# Altium schematic sheet Basic-Logic-Gates-Sheet.SchDoc
size A; SheetNumber: 1; SheetTotal: 1
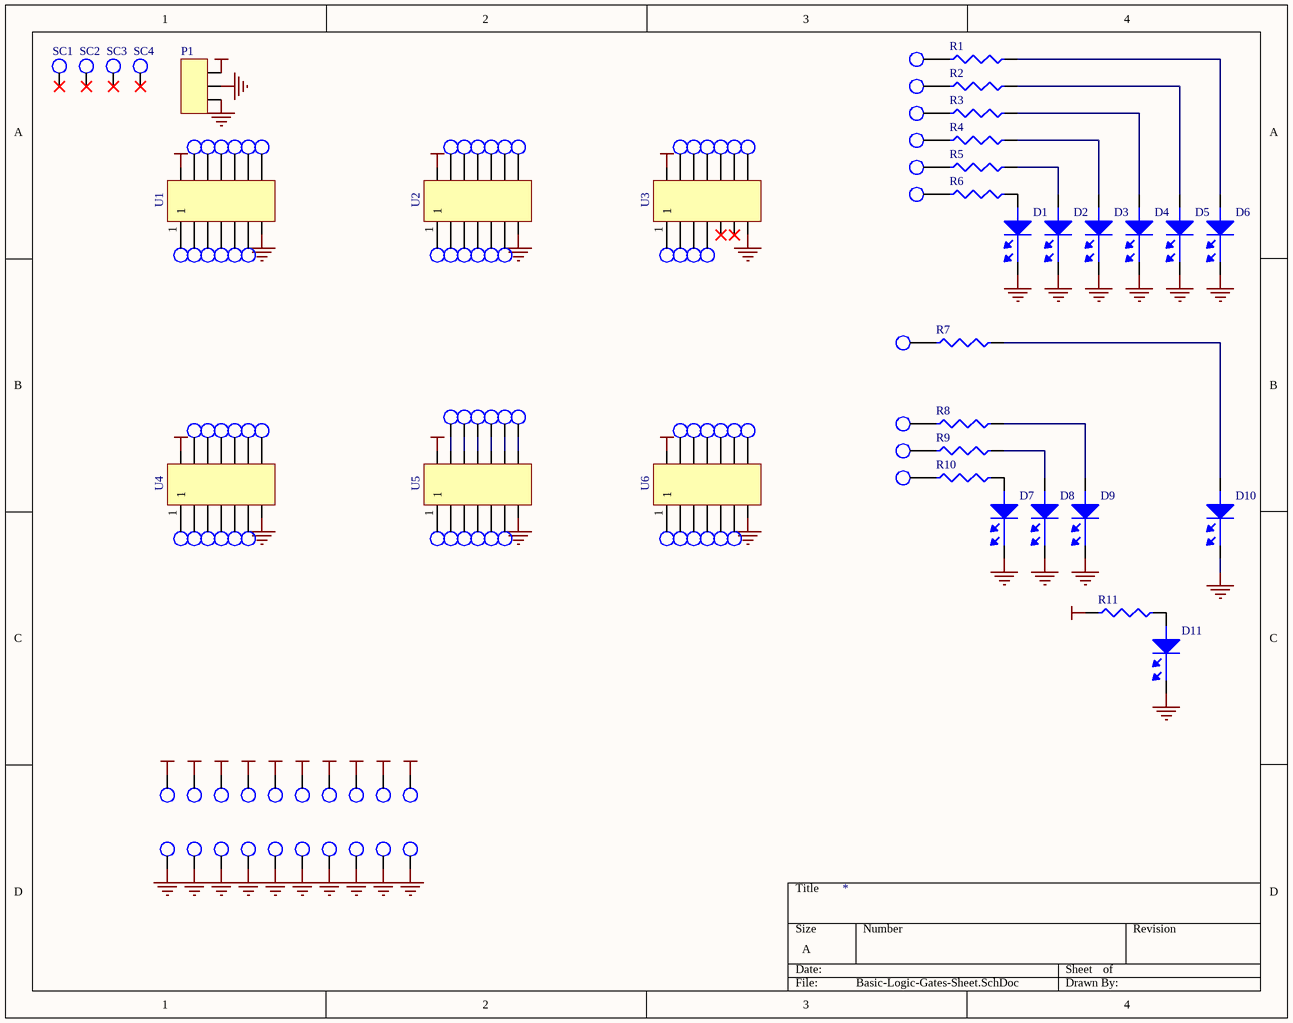
[diagram p0: Basic-Logic-Gates-Sheet.SchDoc]

## Parts
D1  5mm LED  [LED]  (value not drawn)
D2  5mm LED  [LED]  (value not drawn)
D3  5mm LED  [LED]  (value not drawn)
D4  5mm LED  [LED]  (value not drawn)
D5  5mm LED  [LED]  (value not drawn)
D6  5mm LED  [LED]  (value not drawn)
D7  5mm LED  [LED]  (value not drawn)
D8  5mm LED  [LED]  (value not drawn)
D9  5mm LED  [LED]  (value not drawn)
D10  5mm LED  [LED]  (value not drawn)
D11  5mm LED  [LED]  (value not drawn)
J1  Jack  [Connector]  (value not drawn)
J2  Jack  [Connector]  (value not drawn)
J3  Jack  [Connector]  (value not drawn)
J4  Jack  [Connector]  (value not drawn)
J5  Jack  [Connector]  (value not drawn)
J6  Jack  [Connector]  (value not drawn)
J7  Jack  [Connector]  (value not drawn)
J8  Jack  [Connector]  (value not drawn)
J9  Jack  [Connector]  (value not drawn)
J10  Jack  [Connector]  (value not drawn)
J11  Jack  [Connector]  (value not drawn)
J12  Jack  [Connector]  (value not drawn)
J13  Jack  [Connector]  (value not drawn)
J14  Jack  [Connector]  (value not drawn)
J15  Jack  [Connector]  (value not drawn)
J16  Jack  [Connector]  (value not drawn)
J17  Jack  [Connector]  (value not drawn)
J18  Jack  [Connector]  (value not drawn)
J19  Jack  [Connector]  (value not drawn)
J20  Jack  [Connector]  (value not drawn)
J21  Jack  [Connector]  (value not drawn)
J22  Jack  [Connector]  (value not drawn)
J23  Jack  [Connector]  (value not drawn)
J24  Jack  [Connector]  (value not drawn)
J25  Jack  [Connector]  (value not drawn)
J26  Jack  [Connector]  (value not drawn)
J27  Jack  [Connector]  (value not drawn)
J28  Jack  [Connector]  (value not drawn)
J29  Jack  [Connector]  (value not drawn)
J30  Jack  [Connector]  (value not drawn)
J31  Jack  [Connector]  (value not drawn)
J32  Jack  [Connector]  (value not drawn)
J33  Jack  [Connector]  (value not drawn)
J34  Jack  [Connector]  (value not drawn)
J35  Jack  [Connector]  (value not drawn)
J36  Jack  [Connector]  (value not drawn)
J37  Jack  [Connector]  (value not drawn)
J38  Jack  [Connector]  (value not drawn)
J39  Jack  [Connector]  (value not drawn)
J40  Jack  [Connector]  (value not drawn)
J41  Jack  [Connector]  (value not drawn)
J42  Jack  [Connector]  (value not drawn)
J43  Jack  [Connector]  (value not drawn)
J44  Jack  [Connector]  (value not drawn)
J45  Jack  [Connector]  (value not drawn)
J46  Jack  [Connector]  (value not drawn)
J47  Jack  [Connector]  (value not drawn)
J48  Jack  [Connector]  (value not drawn)
J49  Jack  [Connector]  (value not drawn)
J50  Jack  [Connector]  (value not drawn)
J51  Jack  [Connector]  (value not drawn)
J52  Jack  [Connector]  (value not drawn)
J53  Jack  [Connector]  (value not drawn)
J54  Jack  [Connector]  (value not drawn)
J55  Jack  [Connector]  (value not drawn)
J56  Jack  [Connector]  (value not drawn)
J57  Jack  [Connector]  (value not drawn)
J58  Jack  [Connector]  (value not drawn)
J59  Jack  [Connector]  (value not drawn)
J60  Jack  [Connector]  (value not drawn)
J61  Jack  [Connector]  (value not drawn)
J62  Jack  [Connector]  (value not drawn)
J63  Jack  [Connector]  (value not drawn)
J64  Jack  [Connector]  (value not drawn)
J65  Jack  [Connector]  (value not drawn)
J66  Jack  [Connector]  (value not drawn)
J67  Jack  [Connector]  (value not drawn)
J68  Jack  [Connector]  (value not drawn)
J69  Jack  [Connector]  (value not drawn)
J70  Jack  [Connector]  (value not drawn)
J71  Jack  [Connector]  (value not drawn)
J72  Jack  [Connector]  (value not drawn)
J73  Jack  [Connector]  (value not drawn)
J74  Jack  [Connector]  (value not drawn)
J75  Jack  [Connector]  (value not drawn)
J76  Jack  [Connector]  (value not drawn)
J77  Jack  [Connector]  (value not drawn)
J78  Jack  [Connector]  (value not drawn)
J79  Jack  [Connector]  (value not drawn)
J80  Jack  [Connector]  (value not drawn)
J81  Jack  [Connector]  (value not drawn)
J82  Jack  [Connector]  (value not drawn)
J83  Jack  [Connector]  (value not drawn)
J84  Jack  [Connector]  (value not drawn)
J85  Jack  [Connector]  (value not drawn)
J86  Jack  [Connector]  (value not drawn)
J87  Jack  [Connector]  (value not drawn)
J88  Jack  [Connector]  (value not drawn)
J89  Jack  [Connector]  (value not drawn)
J90  Jack  [Connector]  (value not drawn)
J91  Jack  [Connector]  (value not drawn)
J92  Jack  [Connector]  (value not drawn)
J93  Jack  [Connector]  (value not drawn)
J94  Jack  [Connector]  (value not drawn)
J95  Jack  [Connector]  (value not drawn)
J96  Jack  [Connector]  (value not drawn)
J97  Jack  [Connector]  (value not drawn)
J98  Jack  [Connector]  (value not drawn)
J99  Jack  [Connector]  (value not drawn)
J100  Jack  [Connector]  (value not drawn)
P1  Power-Point  [Power-Point]  (value not drawn)
R1  Through Hole Resistor  [TH-Resistor]  (value not drawn)
R2  Through Hole Resistor  [TH-Resistor]  (value not drawn)
R3  Through Hole Resistor  [TH-Resistor]  (value not drawn)
R4  Through Hole Resistor  [TH-Resistor]  (value not drawn)
R5  Through Hole Resistor  [TH-Resistor]  (value not drawn)
R6  Through Hole Resistor  [TH-Resistor]  (value not drawn)
R7  Through Hole Resistor  [TH-Resistor]  (value not drawn)
R8  Through Hole Resistor  [TH-Resistor]  (value not drawn)
R9  Through Hole Resistor  [TH-Resistor]  (value not drawn)
R10  Through Hole Resistor  [TH-Resistor]  (value not drawn)
R11  Through Hole Resistor  [TH-Resistor]  (value not drawn)
SC1  Screw-Hole-Point  [Screw-Hole-Point]  (value not drawn)
SC2  Screw-Hole-Point  [Screw-Hole-Point]  (value not drawn)
SC3  Screw-Hole-Point  [Screw-Hole-Point]  (value not drawn)
SC4  Screw-Hole-Point  [Screw-Hole-Point]  (value not drawn)
U1  7400 series IC base  [DIP14]  (value not drawn)
U2  7400 series IC base  [DIP14]  (value not drawn)
U3  7400 series IC base  [DIP14]  (value not drawn)
U4  7400 series IC base  [DIP14]  (value not drawn)
U5  7400 series IC base  [DIP14]  (value not drawn)
U6  7400 series IC base  [DIP14]  (value not drawn)

## Nets
+5: J81.1 J82.1 J83.1 J84.1 J85.1 J86.1 J87.1 J88.1 J89.1 J90.1 P1.1(VCC) R11.1 U1.14 U2.14 U3.14 U4.14 U5.14 U6.14
GND: D1.1 D2.1 D3.1 D4.1 D5.1 D6.1 D7.1 D8.1 D9.1 D10.1 D11.1 J91.1 J92.1 J93.1 J94.1 J95.1 J96.1 J97.1 J98.1 J99.1 J100.1 P1.2(GND) P1.3(GND) U1.7 U2.7 U3.7 U4.7 U5.7 U6.7
NetD1_2: D1.2 R6.2
NetD2_2: D2.2 R5.2
NetD3_2: D3.2 R4.2
NetD4_2: D4.2 R3.2
NetD5_2: D5.2 R2.2
NetD6_2: D6.2 R1.2
NetD7_2: D7.2 R10.2
NetD8_2: D8.2 R9.2
NetD9_2: D9.2 R8.2
NetD10_2: D10.2 R7.2
NetD11_2: D11.2 R11.2
NetJ1_1: J1.1 R1.1
NetJ2_1: J2.1 R2.1
NetJ3_1: J3.1 R3.1
NetJ4_1: J4.1 R4.1
NetJ5_1: J5.1 U1.13
NetJ6_1: J6.1 U1.12
NetJ7_1: J7.1 U1.11
NetJ8_1: J8.1 U1.10
NetJ9_1: J9.1 U1.9
NetJ10_1: J10.1 U1.8
NetJ11_1: J11.1 U2.13
NetJ12_1: J12.1 U2.12
NetJ13_1: J13.1 U2.11
NetJ14_1: J14.1 U2.10
NetJ15_1: J15.1 U2.9
NetJ16_1: J16.1 U2.8
NetJ17_1: J17.1 U3.13
NetJ18_1: J18.1 U3.12
NetJ19_1: J19.1 U3.11
NetJ20_1: J20.1 U3.10
NetJ21_1: J21.1 U3.9
NetJ22_1: J22.1 U3.8
NetJ23_1: J23.1 R5.1
NetJ24_1: J24.1 R6.1
NetJ25_1: J25.1 U1.1
NetJ26_1: J26.1 U1.2
NetJ27_1: J27.1 U1.3
NetJ28_1: J28.1 U1.4
NetJ29_1: J29.1 U1.5
NetJ30_1: J30.1 U1.6
NetJ31_1: J31.1 U2.1
NetJ32_1: J32.1 U2.2
NetJ33_1: J33.1 U2.3
NetJ34_1: J34.1 U2.4
NetJ35_1: J35.1 U2.5
NetJ36_1: J36.1 U2.6
NetJ37_1: J37.1 U3.1
NetJ38_1: J38.1 U3.2
NetJ39_1: J39.1 U3.3
NetJ40_1: J40.1 U3.4
NetJ41_1: J41.1 R7.1
NetJ42_1: J42.1 R8.1
NetJ43_1: J43.1 U5.13
NetJ44_1: J44.1 U5.12
NetJ45_1: J45.1 U5.11
NetJ46_1: J46.1 U5.10
NetJ47_1: J47.1 U5.9
NetJ48_1: J48.1 U5.8
NetJ49_1: J49.1 U4.13
NetJ50_1: J50.1 U4.12
NetJ51_1: J51.1 U4.11
NetJ52_1: J52.1 U4.10
NetJ53_1: J53.1 U4.9
NetJ54_1: J54.1 U4.8
NetJ55_1: J55.1 U6.13
NetJ56_1: J56.1 U6.12
NetJ57_1: J57.1 U6.11
NetJ58_1: J58.1 U6.10
NetJ59_1: J59.1 U6.9
NetJ60_1: J60.1 U6.8
NetJ61_1: J61.1 R9.1
NetJ62_1: J62.1 R10.1
NetJ63_1: J63.1 U4.1
NetJ64_1: J64.1 U4.2
NetJ65_1: J65.1 U4.3
NetJ66_1: J66.1 U4.4
NetJ67_1: J67.1 U4.5
NetJ68_1: J68.1 U4.6
NetJ69_1: J69.1 U5.1
NetJ70_1: J70.1 U5.2
NetJ71_1: J71.1 U5.3
NetJ72_1: J72.1 U5.4
NetJ73_1: J73.1 U5.5
NetJ74_1: J74.1 U5.6
NetJ75_1: J75.1 U6.1
NetJ76_1: J76.1 U6.2
NetJ77_1: J77.1 U6.3
NetJ78_1: J78.1 U6.4
NetJ79_1: J79.1 U6.5
NetJ80_1: J80.1 U6.6

Not connected (* = marked no-connect by the designer): SC1 1*; SC2 1*; SC3 1*; SC4 1*; U3 5* 6*

## Library data of the parts
D1-D11 = LED
J1-J100 = Connector: Jack Connector (Jumper)
P1 = Power-Point: Power supply from encloser connection point
R1-R11 = Resistor
U1-U6 = DIP14